# EasyEDA schematic schematic.json
TITLE: Sheet_1; REV: 1.0; Date: 2024-08-11; Sheet: 1/1; Drawn By: mats.rohtmets; Company: Your Company
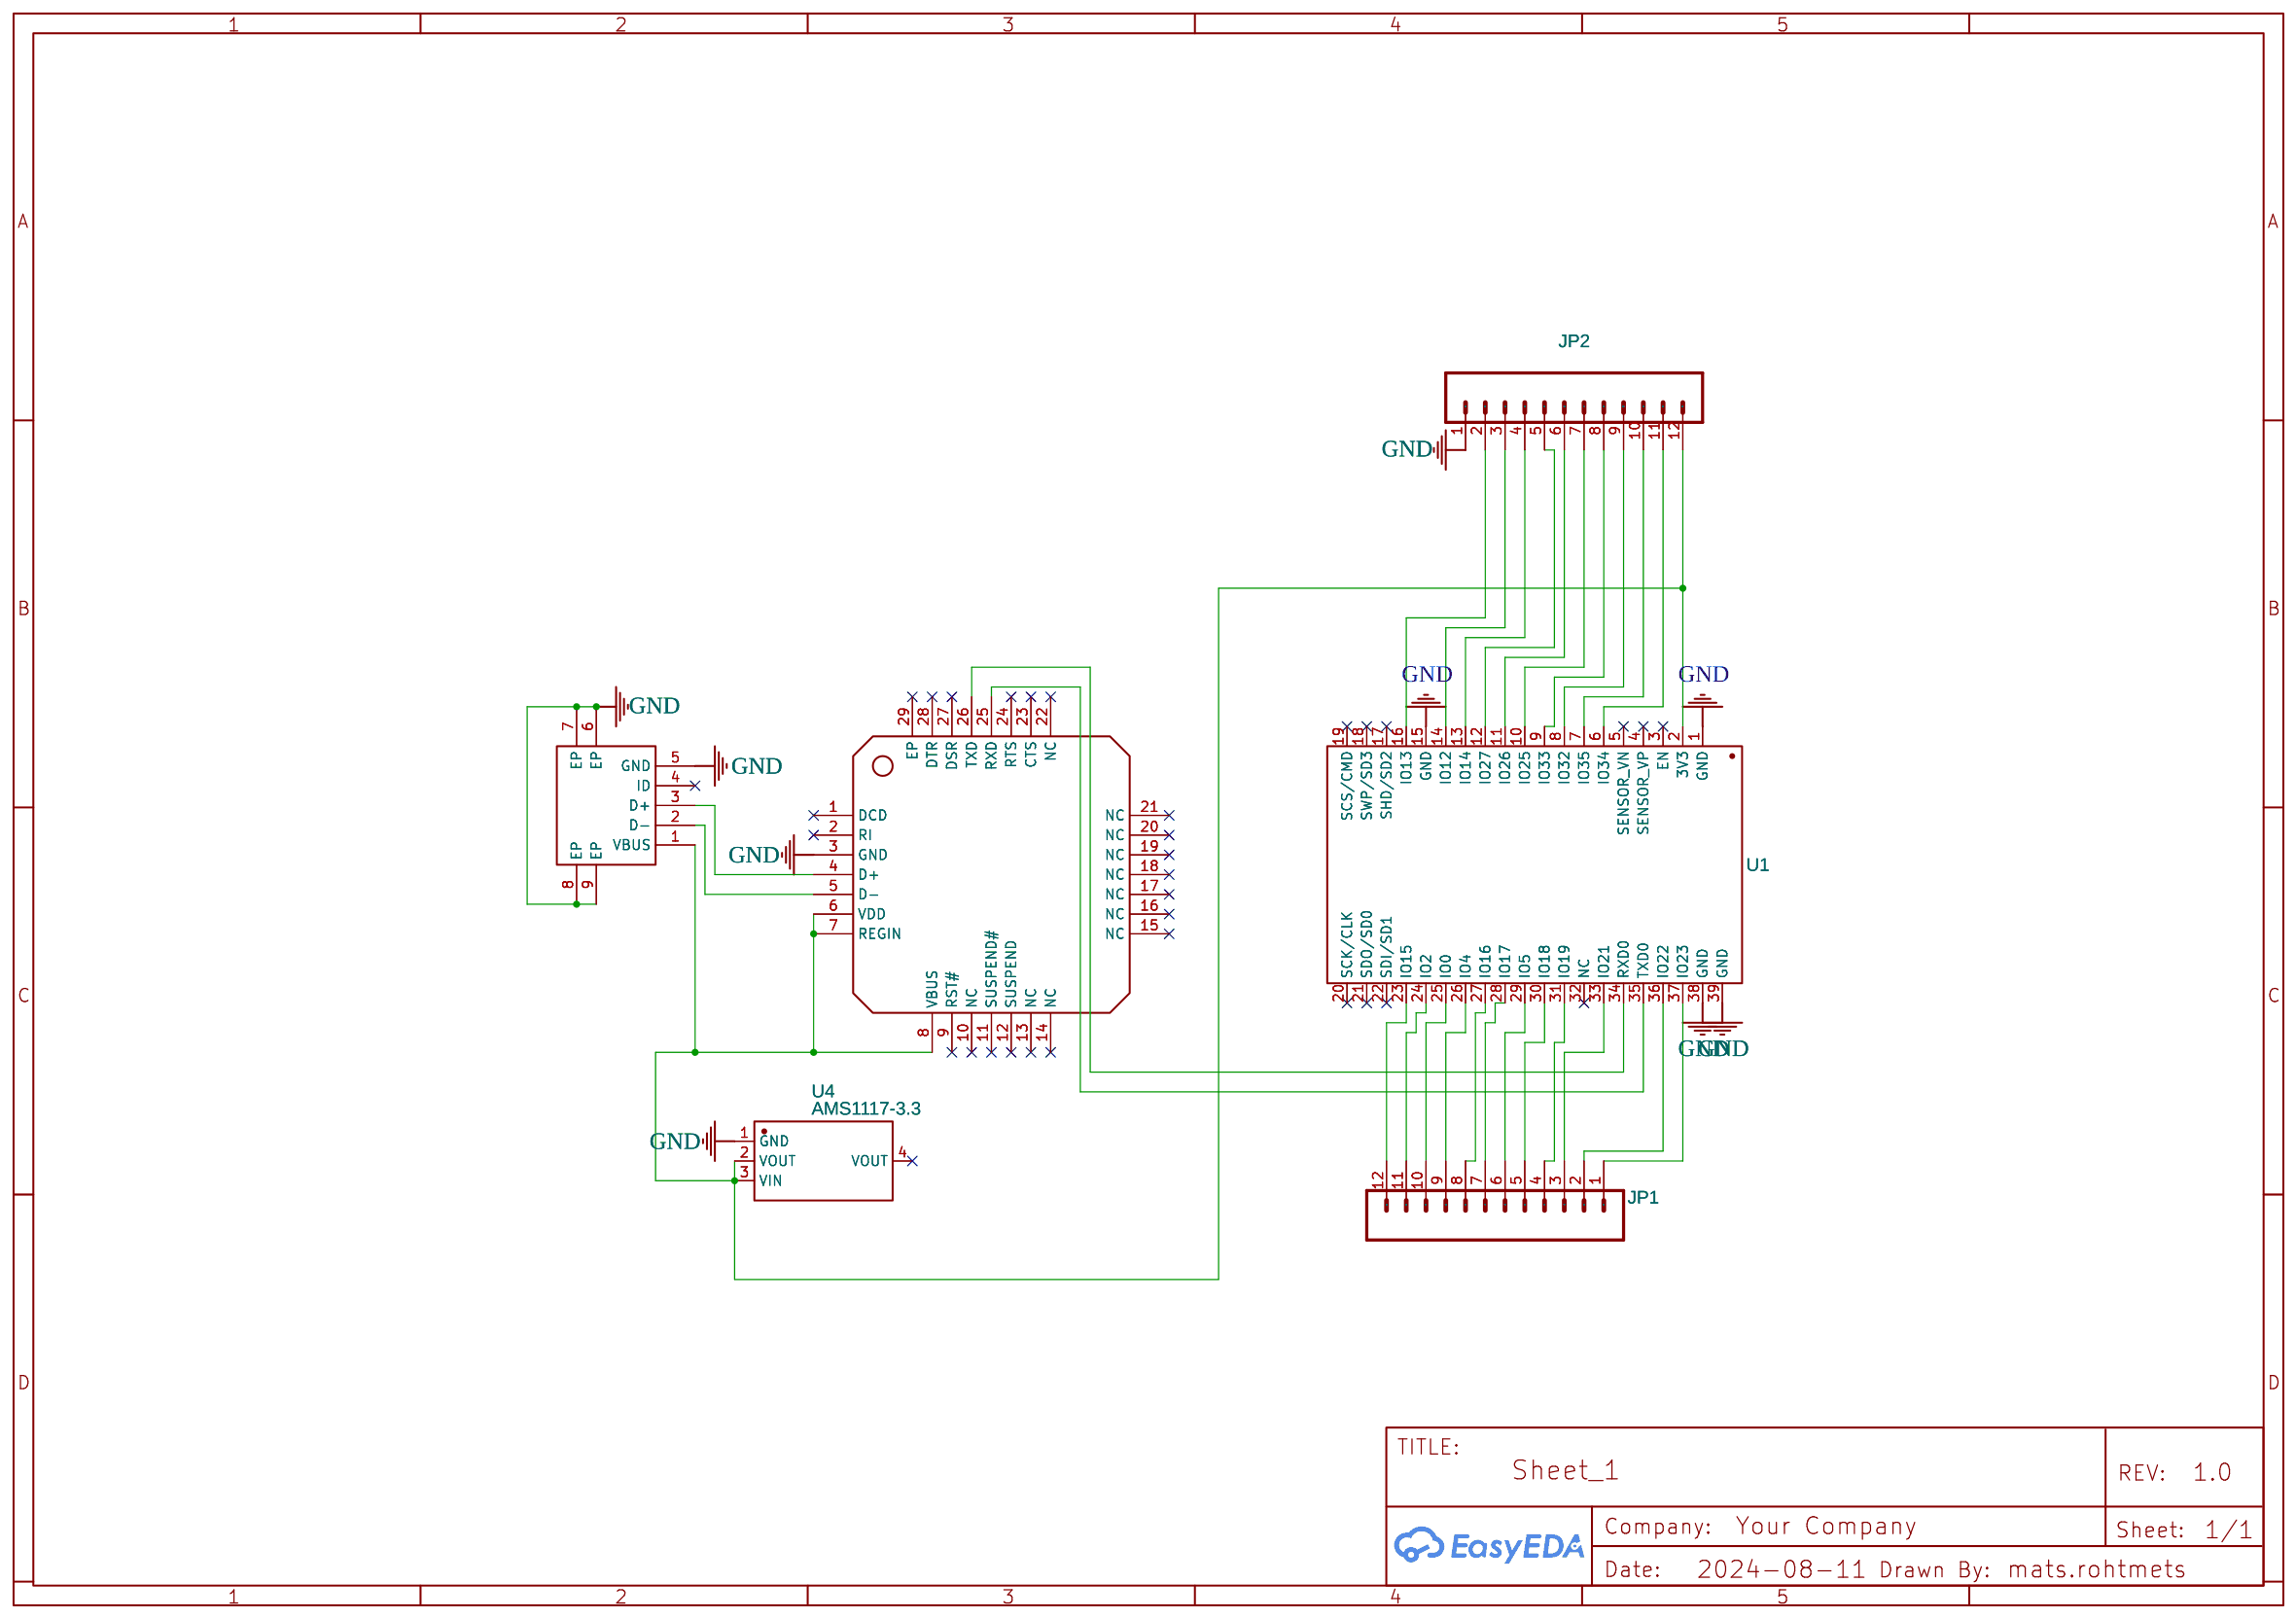
[diagram p0: schematic sheet]

## Parts
JP1  M12MACHINE-PIN_LOCK  [BARRA PINOS 12X1]
JP2  M12MACHINE-PIN_LOCK  [BARRA PINOS 12X1]
U1  ESP32-WROOM-32  [WIFIM-SMD_ESP32-WROOM-32-N4]
U3  CP2102-GMR  [WQFN-28_L5.0-W5.0-P0.50-BL-EP3.2]
U4  AMS1117-3.3  [SOT-223-3_L6.5-W3.4-P2.30-LS7.0-BR]
USB1  MICRO 7.2JB  [MICRO-USB-SMD_MICRO-7.2JB]

## Library data of the parts
JP1 JP2 = M12MACHINE-PIN_LOCK: Contributor: Nathan SETBON; Manufacturer Part: HC-PM254-8.5H-1x12PZ; Supplier Part: C22373898; Manufacturer: Hong Cheng
U1 = ESP32-WROOM-32: Contributor: LCSC; Supplier: LCSC; Supplier Part: C82899; Manufacturer: ESPRESSIF(乐鑫); Manufacturer Part: ESP32-WROOM-32-N4; JLCPCB Part Class: Extended Part
U3 = CP2102-GMR: Supplier: LCSC; Manufacturer: SKYWORKS/SILICON LABS(芯科); Supplier Part: C6568; JLCPCB Part Class: Extended Part
U4 = AMS1117-3.3: sourceId: dwIGgezVh; Supplier: LCSC; Manufacturer: AMS; Supplier Part: C6186; JLCPCB Part Class: Basic Part
USB1 = MICRO 7.2JB: Contributor: LCSC; Supplier: LCSC; Supplier Part: C2681559; Manufacturer: SHOU HAN(首韩); JLCPCB Part Class: Extended Part

## Nets
GND: JP2.1 U1.1(GND) U1.15(GND) U1.38(GND) U1.39(GND) U3.3(GND) U4.1(GND) USB1.5(GND) USB1.6(EP) USB1.7(EP) USB1.8(EP) USB1.9(EP)
Net-(JP1-1): JP1.1 U1.37(IO23)
Net-(JP1-2): JP1.2 U1.36(IO22)
Net-(JP1-3): JP1.3 U1.33(IO21)
Net-(JP1-4): JP1.4 U1.31(IO19)
Net-(JP1-5): JP1.5 U1.30(IO18)
Net-(JP1-6): JP1.6 U1.29(IO5)
Net-(JP1-7): JP1.7 U1.28(IO17)
Net-(JP1-8): JP1.8 U1.27(IO16)
Net-(JP1-9): JP1.9 U1.26(IO4)
Net-(JP1-10): JP1.10 U1.25(IO0)
Net-(JP1-11): JP1.11 U1.24(IO2)
Net-(JP1-12): JP1.12 U1.23(IO15)
Net-(JP2-2): JP2.2 U1.16(IO13)
Net-(JP2-3): JP2.3 U1.14(IO12)
Net-(JP2-4): JP2.4 U1.13(IO14)
Net-(JP2-5): JP2.5 U1.12(IO27)
Net-(JP2-6): JP2.6 U1.11(IO26)
Net-(JP2-7): JP2.7 U1.10(IO25)
Net-(JP2-8): JP2.8 U1.9(IO33)
Net-(JP2-9): JP2.9 U1.8(IO32)
Net-(JP2-10): JP2.10 U1.7(IO35)
Net-(JP2-11): JP2.11 U1.6(IO34)
Net-(JP2-12): JP2.12 U1.2(3V3) U3.6(VDD) U3.7(REGIN) U3.8(VBUS) U4.2(VOUT) U4.3(VIN) USB1.1(VBUS)
Net-(U1-34): U1.34(RXD0) U3.26(TXD)
Net-(U1-35): U1.35(TXD0) U3.25(RXD)
Net-(U3-4): U3.4(D+) USB1.3(D+)
Net-(U3-5): U3.5(D-) USB1.2(D-)

Not connected (* = marked no-connect by the designer): U1 3(EN)* 4(SENSOR_VP)* 5(SENSOR_VN)* 17(SHD/SD2)* 18(SWP/SD3)* 19(SCS/CMD)* 20(SCK/CLK)* 21(SDO/SD0)* 22(SDI/SD1)* 32(NC)*; U3 1(DCD)* 2(RI)* 9(RST#)* 10(NC)* 11(SUSPEND#)* 12(SUSPEND)* 13(NC)* 14(NC)* 15(NC)* 16(NC)* 17(NC)* 18(NC)* 19(NC)* 20(NC)* 21(NC)* 22(NC)* 23(CTS)* 24(RTS)* 27(DSR)* 28(DTR)* 29(EP)*; U4 4(VOUT)*; USB1 4(ID)*
